# Altium schematic sheet nrf52-coprocessor.SchDoc
size A
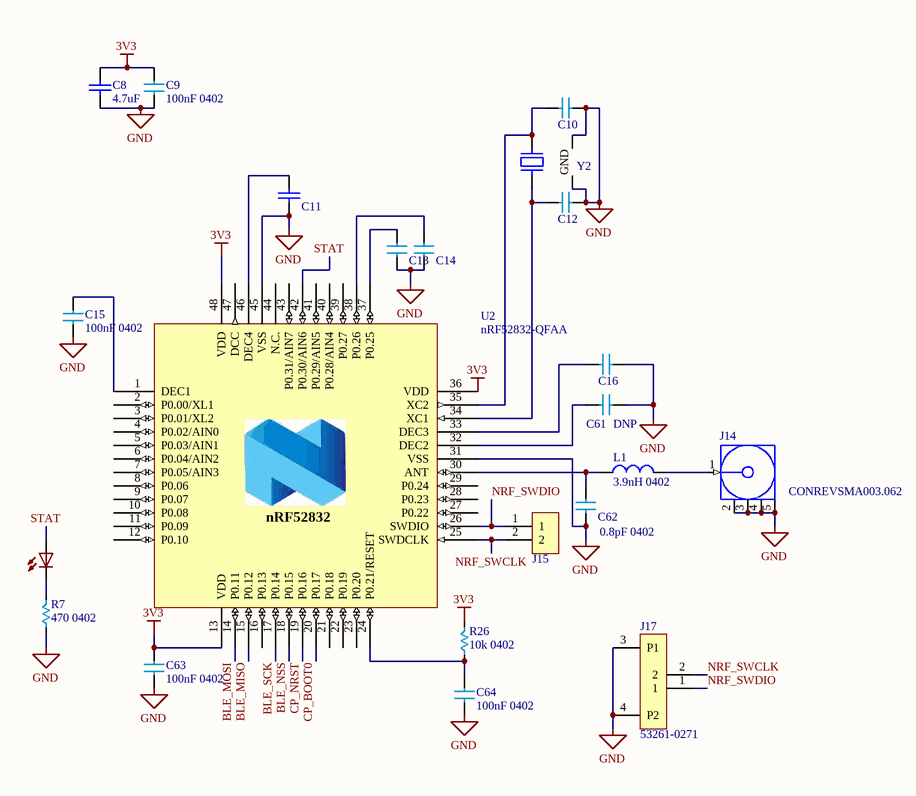
[diagram p0: nrf52-coprocessor.SchDoc]

## Parts
C8  value 4.7uF  [C0603]  (hidden comment: 4.7uF 0603)
C9  100nF 0402  [C0402]
C10  12pF 0402  [C0402]  (value not drawn)
C11  1uF 0603  [C0603]  (value not drawn)
C12  12pF 0402  [C0402]  (value not drawn)
C13  12pF 0402  [C0402]  (value not drawn)
C14  12pF 0402  [C0402]  (value not drawn)
C15  100nF 0402  [C0402]
C16  100pF 0402  [C0402]  (value not drawn)
C61  DNP  [C0402]
C62  0.8pF 0402  [C0402]
C63  100nF 0402  [C0402]
C64  100nF 0402  [C0402]
J14  CONREVSMA003.062  [CON-SMA-EDGE062]
J15  Header 2  [DUAL_PADS]  (value not drawn)
J17  53261-0271  [533980271]
L1  3.9nH 0402  [L0402]
LED5  LED WHITE 0603  [LED_0603]  (value not drawn)
R7  470 0402  [R0402]
R26  10k 0402  [R0402]
U2  nRF52832-QFAA  [QFN40P600X600X90-48N]
Y2  32.0000 MHz 8pf  [NDK NX3225GA]  (value not drawn)

## Nets
3V3: C8.2 C9.2 C63.2 R26.1 U2.13(VDD) U2.36(VDD) U2.48(VDD)
GND: C8.1 C9.1 C10.2 C11.1 C12.2 C13.1 C14.1 C15.1 C16.2 C61.2 C62.2 C63.1 C64.2 J14.2(GND) J14.3(GND) J14.4(GND) J14.5(GND) J17.3(P1) J17.4(P2) R7.2 U2.31(VSS) U2.45(VSS) U2.49(GND) Y2.2(GND) Y2.4(GND)
BLE_MISO: U2.15(P0.12)
BLE_MOSI: U2.14(P0.11)
BLE_NSS: U2.18(P0.15)
BLE_SCK: U2.17(P0.14)
CP_BOOT0: U2.20(P0.17)
CP_NRST: U2.19(P0.16)
NRF_SWCLK: J15.2 J17.2 U2.25(SWDCLK)
NRF_SWDIO: J15.1 J17.1 U2.26(SWDIO)
STAT: LED5.A U2.42(P0.30/AIN6)
NetC10_1: C10.1 U2.35(XC2) Y2.3
NetC11_2: C11.2 U2.46(DEC4)
NetC12_1: C12.1 U2.34(XC1) Y2.1
NetC13_2: C13.2 U2.37(P0.25)
NetC14_2: C14.2 U2.38(P0.26)
NetC15_2: C15.2 U2.1(DEC1)
NetC16_1: C16.1 U2.33(DEC3)
NetC61_1: C61.1 U2.32(DEC2)
NetC62_1: C62.1 L1.1 U2.30(ANT)
NetC64_1: C64.1 R26.2 U2.24(P0.21/RESET)
NetJ14_1: J14.1(Signal) L1.2
NetLED5_C: LED5.C R7.1

Not connected (* = marked no-connect by the designer): U2 2(P0.00/XL1) 3(P0.01/XL2) 4(P0.02/AIN0) 5(P0.03/AIN1) 6(P0.04/AIN2) 7(P0.05/AIN3) 8(P0.06) 9(P0.07) 10(P0.08) 11(P0.09) 12(P0.10) 16(P0.13) 21(P0.18) 22(P0.19) 23(P0.20) 27(P0.22) 28(P0.23) 29(P0.24) 39(P0.27) 40(P0.28/AIN4) 41(P0.29/AIN5) 43(P0.31/AIN7) 44(N.C.) 47(DCC)

## Notes on the sheet
- Title
- Size:
- Date:
- A
- Number:
- Time:
- Revision:
- Sheet
- of
- File:
- (in symbol nRF52832_QFAA) nRF52832

## Library data of the parts
C8 = C-4.7uF-0603: Manufacturer: Samsung; Manufacturer Part Number: CL05F104ZO5NNNC; Description 1: Cap Ceramic 0.1uF 16V Y5V -20% to 80% SMD 0402 85C T/R; Material: Ceramic; Tolerance: 80%; Capacitance: 100nF; Dielectric: Y5V; Voltage Rating: 16V; Description 2: Cap Ceramic 4.7uF 6.3V X5R 20% SMD 0603 85C Paper T/R; Voltage Rating (DC): 6.3V; Published: 8-Jun-2000; LatestRevisionDate: 17-Jul-2002; LatestRevisionNote: Re-released for DXP Platform.; PackageReference: RAD-0.3; Publisher: Altium Limited; Supplier 1: Digi-Key; Supplier Part Number 1: 1276-1004-6-ND; Stock: 8058560; Pricing: 1=0.1, 10=0.024, 100=0.0106, 500=0.00756, 1000=0.00595, 2500=0.00541, 5000=0.00497 (USD); Mount: Surface Mount; Case/Package: 0402; Case Code (Metric): 1005; Case Code (Imperial): 0402; Contact Plating: Tin; Min Operating Temperature: -30°C; Max Operating Temperature: 85°C; Packaging: Tape and Reel; Length: 1mm; Height: 0.5mm; Width: 0.02inch; Thickness: 0.022inch; Depth: 0.5mm; Radiation Hardening: No; ComponentLink1URL: http://www1.futureelectronics.com/doc/SAMSUNG/CL05F104ZO5NNNC.pdf; ComponentLink1Description: http://www1.futureelectronics.com/doc/SAMSUNG/CL05F104ZO5NNNC.pdf; ComponentLink2URL: https://www.verical.com/server-webapp/html/getDatasheet?partID=358403; ComponentLink2Description: https://www.verical.com/server-webapp/html/getDatasheet?partID=358403; ComponentLink3URL: https://produktinfo.conrad.com/datenblaetter/450000-474999/458504-da-01-en-VS_KONDENSATOR_0402.pdf; ComponentLink3Description: https://produktinfo.conrad.com/datenblaetter/450000-474999/458504-da-01-en-VS_KONDENSATOR_0402.pdf; Supplier 2: Digi-Key; Supplier Part Number 2: 1276-1907-6-ND; Manufacturer Part Number 2: CL10A475MQ8NNNC; Package Quantity: 4000; Lead Free: Lead Free; ComponentLink4URL: http://www.samsungsem.com/kr/support/product-search/mlcc/CL10A475MQ8NNNC.jsp?src-supplier=Digi-Key; ComponentLink4Description: http://www.samsungsem.com/kr/support/product-search/mlcc/CL10A475MQ8NNNC.jsp?src-supplier=Digi-Key; ComponentLink5URL: https://www.verical.com/server-webapp/html/getDatasheet?partID=358407&src-supplier=Verical; ComponentLink5Description: https://www.verical.com/server-webapp/html/getDatasheet?partID=358407&src-supplier=Verical; ComponentLink6URL: http://www1.futureelectronics.com/doc/SAMSUNG%20PASSIVE/CL05B104KQ5NNNC.pdf?src-supplier=Future+Electronics; ComponentLink6Description: http://www1.futureelectronics.com/doc/SAMSUNG%20PASSIVE/CL05B104KQ5NNNC.pdf?src-supplier=Future+Electronics
C9 C15 C63 C64 = C0402-100nF
C10 C12-C14 = C0402-12pF
C11 = C-1uF-0603: CAP CER 1UF 10V X7R 0603; Manufacturer: Samsung; Manufacturer Part Number: CL10B105KP8NFNC; Tolerance: 10%; Supplier 1: Digi-Key; RoHS: Yes; Category: Ceramic Capacitors; Stock 1: 137610; Pricing 1: 1=0.10000, 10=0.03200, 50=0.01720, 100=0.01410, 500=0.01008, 1000=0.00793 (USD); Mount: Surface Mount; Case/Package: 0603; Case Code (Metric): 1608; Case Code (Imperial): 0603; Min Operating Temperature: -55°C; Max Operating Temperature: 125°C; Dielectric: X7R; Package Quantity: 1; Packaging: Tape and Reel; Capacitance: 1uF; Voltage Rating: 10V; Length: 0.063inch; Height: 0.8mm; Thickness: 0.035inch; Depth: 0.8mm; Width: 0.031inch; Radiation Hardening: No; ComponentLink1URL: https://datasheet.ciiva.com/25737/cl10b105kp8nfnc-25737841.pdf?src-supplier=Digi-Key; ComponentLink1Description: https://datasheet.ciiva.com/25737/cl10b105kp8nfnc-25737841.pdf?src-supplier=Digi-Key; Supplier Part Number 1: 1276-1945-1-ND
C16 = C0402-100pF
C61 = C0402-100pF: 100pF 0402
C62 = C0402-0.8pF
J14 = CONREVSMA003.062: RP-SMA Female Edge Mount Connector for 0.062" Thick Board; PCB_Layout: Pads complies with manufacturer's recommendation.; PackageVersion: rev1.0, Jun-2006; DatasheetVersion: rev1.0, Jun-2006; PackageDescription: SMA Female Edge Mount for Connector 0.062" Thick Board, Reverse-polarity, 7.9 mm Body Dia.; PackageReference: CON-SMA-EDGE062; PartNumber: CONREVSMA003.062
J15 = DUAL_PADS
J17 = 53261-0271: Headers & Wire Housings 1.25MM HDR 2 CKT Right-Angle; Manufacturer: Molex; Gender: Male; Voltage Rating: 125V; Number of Positions: 2; Current Rating: 1A; Contact Resistance: 20mR; Insulation Resistance: 100MR; Glow Wire Compliant: Non-compliant; Supplier 1: Digi-Key; Supplier Part Number 1: WM7620TR-ND; Manufacturer Part Number 1: 53261-0271; Description 1: Headers & Wire Housings 1.25MM HDR 2 CKT Right-Angle; Stock: 85000; Pricing: 1000=0.4904, 2000=0.45975, 3000=0.44443, 5000=0.4291, 10000=0.40765, 25000=0.39845 (USD); Mount: Surface Mount; Color: Beige; Housing Material: Thermoplastic; Contact Material: Bronze,Tin; Contact Plating: Tin; Min Operating Temperature: -40°C; Max Operating Temperature: 85°C; Packaging: Tape and Reel; Termination: SMD/SMT; Number of Rows: 1; Number of Contacts: 2; Orientation: Right Angle; Package Quantity: 1000; Voltage Rating (AC): 125V; Number of Circuits: 2; Voltage Rating (DC): 125V; Working Voltage: 125V; Pitch: 1.25mm; Lead Pitch: 1.25mm; Radiation Hardening: No; REACH SVHC: Unknown; Lead Free: Lead Free; Flammability Rating: UL94 V-0; ComponentLink1URL: http://uk.rs-online.com/webdocs/13c4/0900766b813c44b8.pdf; ComponentLink1Description: http://uk.rs-online.com/webdocs/13c4/0900766b813c44b8.pdf; ComponentLink2URL: http://www.molex.com/webdocs/datasheets/pdf/en-us/0532610271_PCB_HEADERS.pdf; ComponentLink2Description: http://www.molex.com/webdocs/datasheets/pdf/en-us/0532610271_PCB_HEADERS.pdf; ComponentLink3URL: http://www.alliedelec.com/m/d/74d14d19c60ab078e4881c4c1bd42ef7.pdf; ComponentLink3Description: http://www.alliedelec.com/m/d/74d14d19c60ab078e4881c4c1bd42ef7.pdf; ComponentLink4URL: http://www.farnell.com/datasheets/2697765.pdf; ComponentLink4Description: http://www.farnell.com/datasheets/2697765.pdf; ComponentLink5URL: http://www.farnell.com/datasheets/2144535.pdf; ComponentLink5Description: http://www.farnell.com/datasheets/2144535.pdf; ComponentLink6URL: http://www.farnell.com/datasheets/1626147.pdf; ComponentLink6Description: http://www.farnell.com/datasheets/1626147.pdf; ComponentLink7URL: http://www.mouser.com/ds/2/276/0532610271_PCB_HEADERS-171053.pdf; ComponentLink7Description: http://www.mouser.com/ds/2/276/0532610271_PCB_HEADERS-171053.pdf; ComponentLink8URL: http://www.farnell.com/datasheets/2038817.pdf; ComponentLink8Description: http://www.farnell.com/datasheets/2038817.pdf; ComponentLink9URL: http://www.jameco.com/Jameco/Products/ProdDS/1932547.pdf; ComponentLink9Description: http://www.jameco.com/Jameco/Products/ProdDS/1932547.pdf
L1 = L0402-3.9nH: Manufacturer: Murata; Manufacturer Part Number 1: LQG15HN3N9S02D; Description 1: FIXED IND 3.9NH 700MA 190 MOHM; Core Material: Air; Self Resonant Frequency: 6GHz; DC Resistance (DCR): 190mR; Test Frequency: 100MHz; Max DC Current: 300mA; Q Factor: 8; Shielding: Unshielded; Supplier 1: Digi-Key; Supplier Part Number 1: 490-1079-6-ND; Stock: 35032; Pricing: 1=0.1, 10=0.061, 100=0.0404, 500=0.03366, 1000=0.02827, 2500=0.02423 (USD); Mount: Surface Mount; Case/Package: 0402; Number of Pins: 2; Case Code (Metric): 1005; Case Code (Imperial): 0402; Min Operating Temperature: -55°C; Max Operating Temperature: 125°C; Packaging: Tape and Reel; Inductance: 3.9nH; Package Quantity: 10000; Termination: SMD/SMT; DC Current: 300mA; Military Standard: Not; Current Rating: 300mA; Length: 1mm; Height: 0.02inch; Width: 0.02inch; Depth: 0.55mm; Height - Seated (Max): 0.022inch; Radiation Hardening: No; REACH SVHC: No SVHC; Lead Free: Lead Free; ComponentLink1URL: https://search.murata.co.jp/Ceramy/image/img/P02/partnumberingAT_LQ3E.pdf?src-supplier=Digi-Key; ComponentLink1Description: https://search.murata.co.jp/Ceramy/image/img/P02/partnumberingAT_LQ3E.pdf?src-supplier=Digi-Key; ComponentLink2URL: http://uk.rs-online.com/webdocs/0f10/0900766b80f10808.pdf?src-supplier=RSComponents; ComponentLink2Description: http://uk.rs-online.com/webdocs/0f10/0900766b80f10808.pdf?src-supplier=RSComponents; ComponentLink3URL: http://search.murata.co.jp/Ceramy/image/img/PDF/ENG/L0075S0083LQG15HN.pdf?src-supplier=Avnet+Europe; ComponentLink3Description: http://search.murata.co.jp/Ceramy/image/img/PDF/ENG/L0075S0083LQG15HN.pdf?src-supplier=Avnet+Europe; ComponentLink4URL: http://www.farnell.com/datasheets/66026.pdf?src-supplier=Farnell; ComponentLink4Description: http://www.farnell.com/datasheets/66026.pdf?src-supplier=Farnell
LED5 = LED_ESML0603: LED   Source: http://www.osram.convergy.de   Source: www.luxeon.com   Source: www.kingbright.com; Manufacturer: Dialight; Manufacturer Part Number: 5988070107F; Description 1: DIALIGHT - 5988070107F - LED, 0603, GREEN, 20MCD, 566NM; Color: Green; Lens Color: Colorless,Clear; Forward Voltage: 2V; Forward Current: 20mA; Wavelength: 570nm; Luminous Intensity: 20mcd; Viewing Angle: 140°; Lens Style: Flat,Rectangular,Diffused,Colorless,Clear; Dominant Wavelength: 568nm; Number of Elements: 1; Power Dissipation: 60mW; Reverse Voltage: 5V; Lens Transparency: Clear; Lens Size: 0.8mm; SPICEMODEL: NONE; SPICEPREFIX: D; SPICETYPE: diode; Supplier 1: Digi-Key; Supplier Part Number 1: 350-2035-6-ND; Stock: 221494; Pricing: 1=0.48, 10=0.346, 25=0.2652, 100=0.1731, 250=0.12692, 500=0.1077, 1000=0.08846 (USD); Mount: Surface Mount; Case/Package: 0603; Number of Pins: 2; Case Code (Metric): 1608; Case Code (Imperial): 0603; Min Operating Temperature: -30°C; Max Operating Temperature: 100°C; Package Quantity: 4000; Packaging: Tape and Reel; Illumination Color: Green; Test Current: 20mA; Number of LEDs: 1; Length: 1.6mm; Height: 0.7mm; Depth: 0.8mm; Width: 0.8mm; Radiation Hardening: No; Lead Free: Lead Free; REACH SVHC: No SVHC; ComponentLink1URL: http://www.mouser.com/ds/2/109/SMT_selector_guide-267443.pdf?src-supplier=Mouser; ComponentLink1Description: http://www.mouser.com/ds/2/109/SMT_selector_guide-267443.pdf?src-supplier=Mouser; ComponentLink2URL: http://uk.rs-online.com/webdocs/0ae2/0900766b80ae2975.pdf?src-supplier=RSComponents; ComponentLink2Description: http://uk.rs-online.com/webdocs/0ae2/0900766b80ae2975.pdf?src-supplier=RSComponents; ComponentLink3URL: http://www.farnell.com/datasheets/1720200.pdf?src-supplier=Element14; ComponentLink3Description: http://www.farnell.com/datasheets/1720200.pdf?src-supplier=Element14; ComponentLink4URL: https://media.digikey.com/pdf/Data%20Sheets/Dialight%20PDFs/598_Series_0603_Pkg.pdf?src-supplier=Digi-Key; ComponentLink4Description: https://media.digikey.com/pdf/Data%20Sheets/Dialight%20PDFs/598_Series_0603_Pkg.pdf?src-supplier=Digi-Key; ComponentLink5URL: http://www.farnell.com/datasheets/1484480.pdf?src-supplier=Element14; ComponentLink5Description: http://www.farnell.com/datasheets/1484480.pdf?src-supplier=Element14; ComponentLink6URL: https://www.alliedelec.com/m/d/745256ca487aea7b70ea31e2d673d5bb.pdf?src-supplier=Allied+Electronics; ComponentLink6Description: https://www.alliedelec.com/m/d/745256ca487aea7b70ea31e2d673d5bb.pdf?src-supplier=Allied+Electronics; ComponentLink7URL: http://www.onlinecomponents.com/productFiles/mf-DIA/mdei5980603.pdf?src-supplier=Onlinecomponents.com; ComponentLink7Description: http://www.onlinecomponents.com/productFiles/mf-DIA/mdei5980603.pdf?src-supplier=Onlinecomponents.com; ComponentLink8URL: https://www.verical.com/server-webapp/html/getDatasheet?partID=146438&src-supplier=Verical; ComponentLink8Description: https://www.verical.com/server-webapp/html/getDatasheet?partID=146438&src-supplier=Verical; ComponentLink9URL: http://www.dialight.com/Assets/Brochures_And_Catalogs/Indication/SMT_selector_guide.pdf?src-supplier=Future+Electronics; ComponentLink9Description: http://www.dialight.com/Assets/Brochures_And_Catalogs/Indication/SMT_selector_guide.pdf?src-supplier=Future+Electronics
R7 = R-470-0402: Manufacturer: Yageo; Manufacturer Part Number: RC0402JR-07470RL; Description 1: RES SMD 470 OHM 5% 1/16W 0402; Tolerance: 5%; Voltage Rating: 50V; Resistance: 470R; Power Rating: 62.5mW; Temperature Coefficient: 100ppm/°C; Max Power Dissipation: 63mW; Supplier 1: Digi-Key; Supplier Part Number 1: 311-470JRDKR-ND; Stock: 2903670; Pricing: 1=0.1, 10=0.013, 100=0.0055, 1000=0.00245, 2500=0.00212, 5000=0.00176 (USD); Case/Package: 0402; Case Code (Metric): 1005; Case Code (Imperial): 0402; Min Operating Temperature: -55°C; Max Operating Temperature: 155°C; Packaging: Tape and Reel; Package Quantity: 1; Termination: SMD/SMT; Composition: Thick Film; Features: Moisture Resistant; Number of Terminations: 2; Military Standard: Not; Working Voltage: 50V; Length: 1mm; Height: 0.016inch; Width: 0.02inch; Depth: 0.5mm; REACH SVHC: Unknown; Lead Free: Lead Free; ComponentLink1URL: http://www.yageo.com/documents/recent/PYu-RC_Group_51_RoHS_L_10.pdf?src-supplier=Digi-Key; ComponentLink1Description: http://www.yageo.com/documents/recent/PYu-RC_Group_51_RoHS_L_10.pdf?src-supplier=Digi-Key; ComponentLink2URL: http://www.farnell.com/datasheets/1018594.pdf?src-supplier=Element14; ComponentLink2Description: http://www.farnell.com/datasheets/1018594.pdf?src-supplier=Element14; ComponentLink3URL: http://www.mouser.com/ds/2/447/PYu-RC0402_51_RoHS_L_6_r-8721.pdf?src-supplier=Mouser; ComponentLink3Description: http://www.mouser.com/ds/2/447/PYu-RC0402_51_RoHS_L_6_r-8721.pdf?src-supplier=Mouser
R26 = R-10k-0402: Value: 10k
U2 = nRF52832_QFAA: Multi-protocol Bluetooth Low Energy, ANT and 2.4GHz proprietary system-on-chip; Manufacturer: Nordic Semiconductor; Artikkelnr Noca: N.A.; Part Number: nRF52832-QFAA; Manufacturer Part Number: nRF52832-QFAA; Datasheet: *; LatestRevisionDate: 2014-11-26; Pin Count: 48; Publisher: Nordic Semiconductor; Published: 2014-11-26; Value: nRF52832-QFAA; Note: *; Supplier: Nordic Semiconductor; Supplier part number: *; 2nd source Supplier: *; 2nd source part number: *; Footprint Doc: QFN-48; Artikkelnr Simpro: N.A.
Y2 = NX3225SA-32MHZ-EXS00A-CS02368: CRYSTAL 32.0000MHZ 9PF SMD; Manufacturer: NDK; Frequency: 32MHz; Frequency Tolerance: 10ppm; ESR (Equivalent Series Resistance): 50R; Frequency Stability: 16ppm; ComponentLink1URL: https://datasheet.ciiva.com/18026/getdatasheetpartid-683563-18026983.pdf?src-supplier=Verical; ComponentLink1Description: https://datasheet.ciiva.com/18026/getdatasheetpartid-683563-18026983.pdf?src-supplier=Verical; Supplier 1: Digi-Key; RoHS: Yes; Category: Crystals; Stock 1: 6900; Pricing 1: 1=0.75000, 10=0.66200, 50=0.61920, 100=0.54720, 500=0.51840, 1000=0.43200 (USD); Mount: Surface Mount; Case/Package: SMD/SMT; Min Operating Temperature: -40°C; Max Operating Temperature: 85°C; Package Quantity: 1; Packaging: Cut Tape; Load Capacitance: 9pF; Series: NX3225SA; Length: 0.126inch; Width: 0.098inch; Height: 0.022inch; ComponentLink2URL: https://datasheet.ciiva.com/15047/nx3225sa20exs00a-cs02368-15047029.pdf?src-supplier=Digi-Key; ComponentLink2Description: https://datasheet.ciiva.com/15047/nx3225sa20exs00a-cs02368-15047029.pdf?src-supplier=Digi-Key; ComponentLink3URL: https://datasheet.ciiva.com/15047/nx3225saexs00a-cs02368-15047030.pdf?src-supplier=Digi-Key; ComponentLink3Description: https://datasheet.ciiva.com/15047/nx3225saexs00a-cs02368-15047030.pdf?src-supplier=Digi-Key; ComponentLink4URL: https://datasheet.ciiva.com/15047/nx3225saexs00a-cs02368-15047031.pdf?src-supplier=Digi-Key; ComponentLink4Description: https://datasheet.ciiva.com/15047/nx3225saexs00a-cs02368-15047031.pdf?src-supplier=Digi-Key; Supplier Part Number 1: 644-1208-1-ND; Manufacturer Part Number: NX3225SA-32MHZ-EXS00A-CS02368